# EAGLE design led_smd (EAGLE 9.6.2)
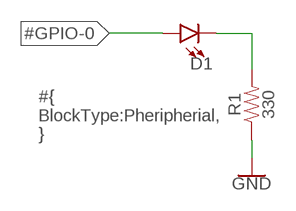
[diagram p0: schematic, sheet 1]

## Parts
D1  LED1206  [LED-1206]
R1  330  RESISTOR1206  [1206]

## Nets
#GPIO-0: D1.A
GND: R1.1
N$1: D1.C R1.2

## Notes on the sheet
- #{
  BlockType:Pheripherial,
  }

## Library data of the parts
D1 = SparkFun-LED:LED: LED (Generic) Standard schematic elements and footprints for 5mm, 3mm, 1206, and 0603 sized LEDs. Generic LEDs with no color specified.
R1 = SparkFun-Resistors:RESISTOR: Generic Resistor Package

## Net classes
0 default: width 0.178 mm
1 vcc: width 0.203 mm

## Board
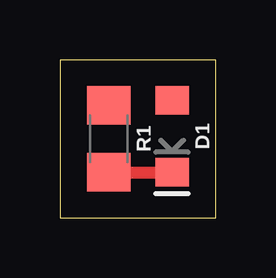
[diagram p1: board, top side]

Size 6.5 x 6.6 mm. Coordinates in mm from the lower left corner, seen from the top.
Outline: 0,0 6.5,0 6.5,6.6 0,6.6 0,0
Copper layers (1*16): Top 0.035mm / dielectric 1.5mm / Bottom 0.035mm
Design rules "default": minimum track width 6mil, minimum drill 0.35mm, track to track 6mil, track to pad 6mil, pad to pad 6mil, via to via 6mil, smd to smd 6mil, copper to edge 40mil, drill to drill 6mil, minimum pad ring 10mil, minimum via ring 8mil, stop-mask expansion 4mil, vias tented up to drill 0mil, thermal gap 10mil

### Footprints (pad centres in the part's own frame; a part is rotated, then mirrored left to right if it is on the bottom)
LED-1206 = smd 1.2 x 1.4: A -1.5,0; C 1.5,0
1206 = smd 1.6 x 1.8: 1 -1.4,0; 2 1.4,0

### Placement (x,y rotation side)
D1  4.68,3.41 270 top
R1  2.04,3.31 270 top

### Tracks (layer width: path | path; a pad name or v marks a point on that pad's centre or on a via)
N$1
  Top 0.508: R1.2 D1.C